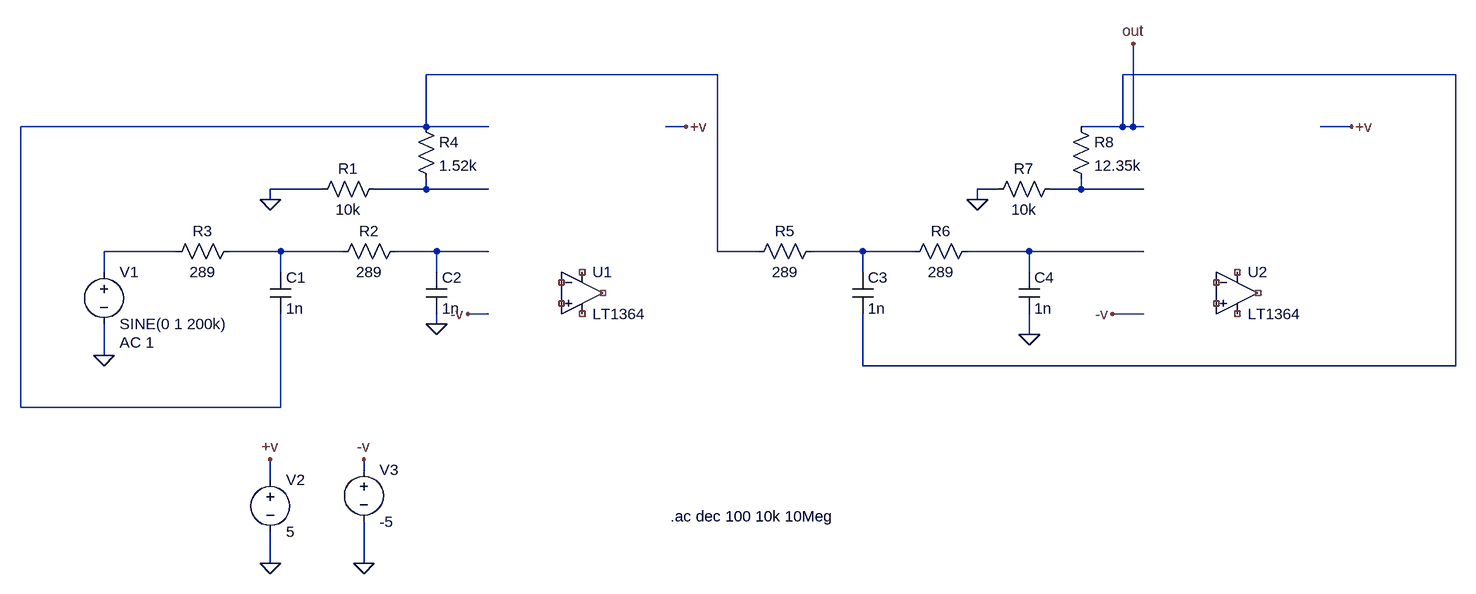
[diagram p0: schematic Draft2.asc]
Draft2.asc, the LTspice schematic file:
Version 4.1
SHEET 1 1556 680
WIRE 416 -112 -32 -112
WIRE 1552 -112 1040 -112
WIRE -32 -32 -32 -112
WIRE -32 -32 -656 -32
WIRE 64 -32 -32 -32
WIRE 368 -32 336 -32
WIRE 1040 -32 1040 -112
WIRE 1040 -32 976 -32
WIRE 1056 -32 1056 -160
WIRE 1056 -32 1040 -32
WIRE 1072 -32 1056 -32
WIRE 1392 -32 1344 -32
WIRE -192 64 -272 64
WIRE -32 64 -32 48
WIRE -32 64 -112 64
WIRE 64 64 -32 64
WIRE 848 64 816 64
WIRE 976 64 976 48
WIRE 976 64 928 64
WIRE 1072 64 976 64
WIRE -272 80 -272 64
WIRE 816 80 816 64
WIRE -416 160 -528 160
WIRE -256 160 -336 160
WIRE -160 160 -256 160
WIRE -16 160 -80 160
WIRE 64 160 -16 160
WIRE 416 160 416 -112
WIRE 480 160 416 160
WIRE 640 160 560 160
WIRE 720 160 640 160
WIRE 896 160 800 160
WIRE 1072 160 896 160
WIRE -528 192 -528 160
WIRE -256 192 -256 160
WIRE -16 192 -16 160
WIRE 640 192 640 160
WIRE 896 192 896 160
WIRE 64 256 32 256
WIRE 1072 256 1024 256
WIRE -16 272 -16 256
WIRE 896 288 896 256
WIRE -528 320 -528 272
WIRE 640 336 640 256
WIRE 1552 336 1552 -112
WIRE 1552 336 640 336
WIRE -656 400 -656 -32
WIRE -256 400 -256 256
WIRE -256 400 -656 400
WIRE -128 496 -128 480
WIRE -272 512 -272 480
WIRE -272 640 -272 592
WIRE -128 640 -128 576
FLAG -272 80 0
FLAG -16 272 0
FLAG -528 320 0
FLAG -272 640 0
FLAG -128 640 0
FLAG -272 480 +v
FLAG 368 -32 +v
FLAG -128 480 -v
FLAG 32 256 -v
FLAG 896 288 0
FLAG 816 80 0
FLAG 1024 256 -v
FLAG 1392 -32 +v
FLAG 1056 -160 out
SYMBOL OpAmps\\LT1364 208 160 R0
SYMATTR InstName U1
SYMBOL OpAmps\\LT1364 1216 160 R0
SYMATTR InstName U2
SYMBOL res -96 48 R90
WINDOW 0 0 56 VBottom 2
WINDOW 3 32 56 VTop 2
SYMATTR InstName R1
SYMATTR Value 10k
SYMBOL res -64 144 R90
WINDOW 0 0 56 VBottom 2
WINDOW 3 32 56 VTop 2
SYMATTR InstName R2
SYMATTR Value 289
SYMBOL res -320 144 R90
WINDOW 0 0 56 VBottom 2
WINDOW 3 32 56 VTop 2
SYMATTR InstName R3
SYMATTR Value 289
SYMBOL cap -272 192 R0
SYMATTR InstName C1
SYMATTR Value 1n
SYMBOL cap -32 192 R0
SYMATTR InstName C2
SYMATTR Value 1n
SYMBOL voltage -528 176 R0
WINDOW 123 24 124 Left 2
WINDOW 39 0 0 Left 0
SYMATTR InstName V1
SYMATTR Value SINE(0 1 200k)
SYMATTR Value2 AC 1
SYMBOL res -48 -48 R0
SYMATTR InstName R4
SYMATTR Value 1.52k
SYMBOL voltage -272 496 R0
WINDOW 123 0 0 Left 0
WINDOW 39 0 0 Left 0
SYMATTR InstName V2
SYMATTR Value 5
SYMBOL voltage -128 480 R0
WINDOW 123 0 0 Left 0
WINDOW 39 0 0 Left 0
SYMATTR InstName V3
SYMATTR Value -5
SYMBOL res 576 144 R90
WINDOW 0 0 56 VBottom 2
WINDOW 3 32 56 VTop 2
SYMATTR InstName R5
SYMATTR Value 289
SYMBOL res 816 144 R90
WINDOW 0 0 56 VBottom 2
WINDOW 3 32 56 VTop 2
SYMATTR InstName R6
SYMATTR Value 289
SYMBOL cap 624 192 R0
SYMATTR InstName C3
SYMATTR Value 1n
SYMBOL cap 880 192 R0
SYMATTR InstName C4
SYMATTR Value 1n
SYMBOL res 944 48 R90
WINDOW 0 0 56 VBottom 2
WINDOW 3 32 56 VTop 2
SYMATTR InstName R7
SYMATTR Value 10k
SYMBOL res 960 -48 R0
SYMATTR InstName R8
SYMATTR Value 12.35k
TEXT 344 568 Left 2 !.ac dec 100 10k 10Meg

The netlist it stands for:
* Draft2.asc
X§U1 NC_01 NC_02 NC_03 NC_04 NC_05 LT1363  ; LT1364, pins In+ In- V+ V- OUT
X§U2 NC_06 NC_07 NC_08 NC_09 NC_10 LT1363  ; LT1364, pins In+ In- V+ V- OUT
R1 N002 0 10k
R2 N006 N005 289
R3 N005 N004 289
C1 N005 N001 1n
C2 N006 0 1n
V1 N004 0 SINE(0 1 200k) AC 1
R4 N001 N002 1.52k
V2 +v 0 5
V3 -v 0 -5
R5 N007 N001 289
R6 N008 N007 289
C3 N007 out 1n
C4 N008 0 1n
R7 N003 0 10k
R8 out N003 12.35k
.ac dec 100 10k 10Meg
.lib LTC.lib
.backanno
.end